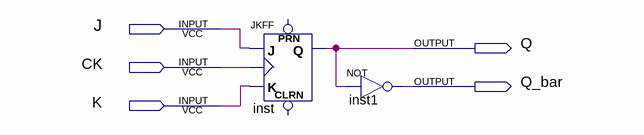
[diagram p0: schematic sheet]
// Quartus schematic JK_FF_1.bdf as structural Verilog: 2 symbols, 5 pins
module JK_FF_1 (
  input  J,
  input  CK,
  input  K,
  output Q,
  output Q_bar
);

  JKFF inst (.K(K), .J(J), .CLK(CK), .Q(Q));  // open: PRN, CLRN
  not inst1 (Q_bar, Q);
endmodule
